# EAGLE design Qwiic_Lidar_Lite (EAGLE 9.4.2)
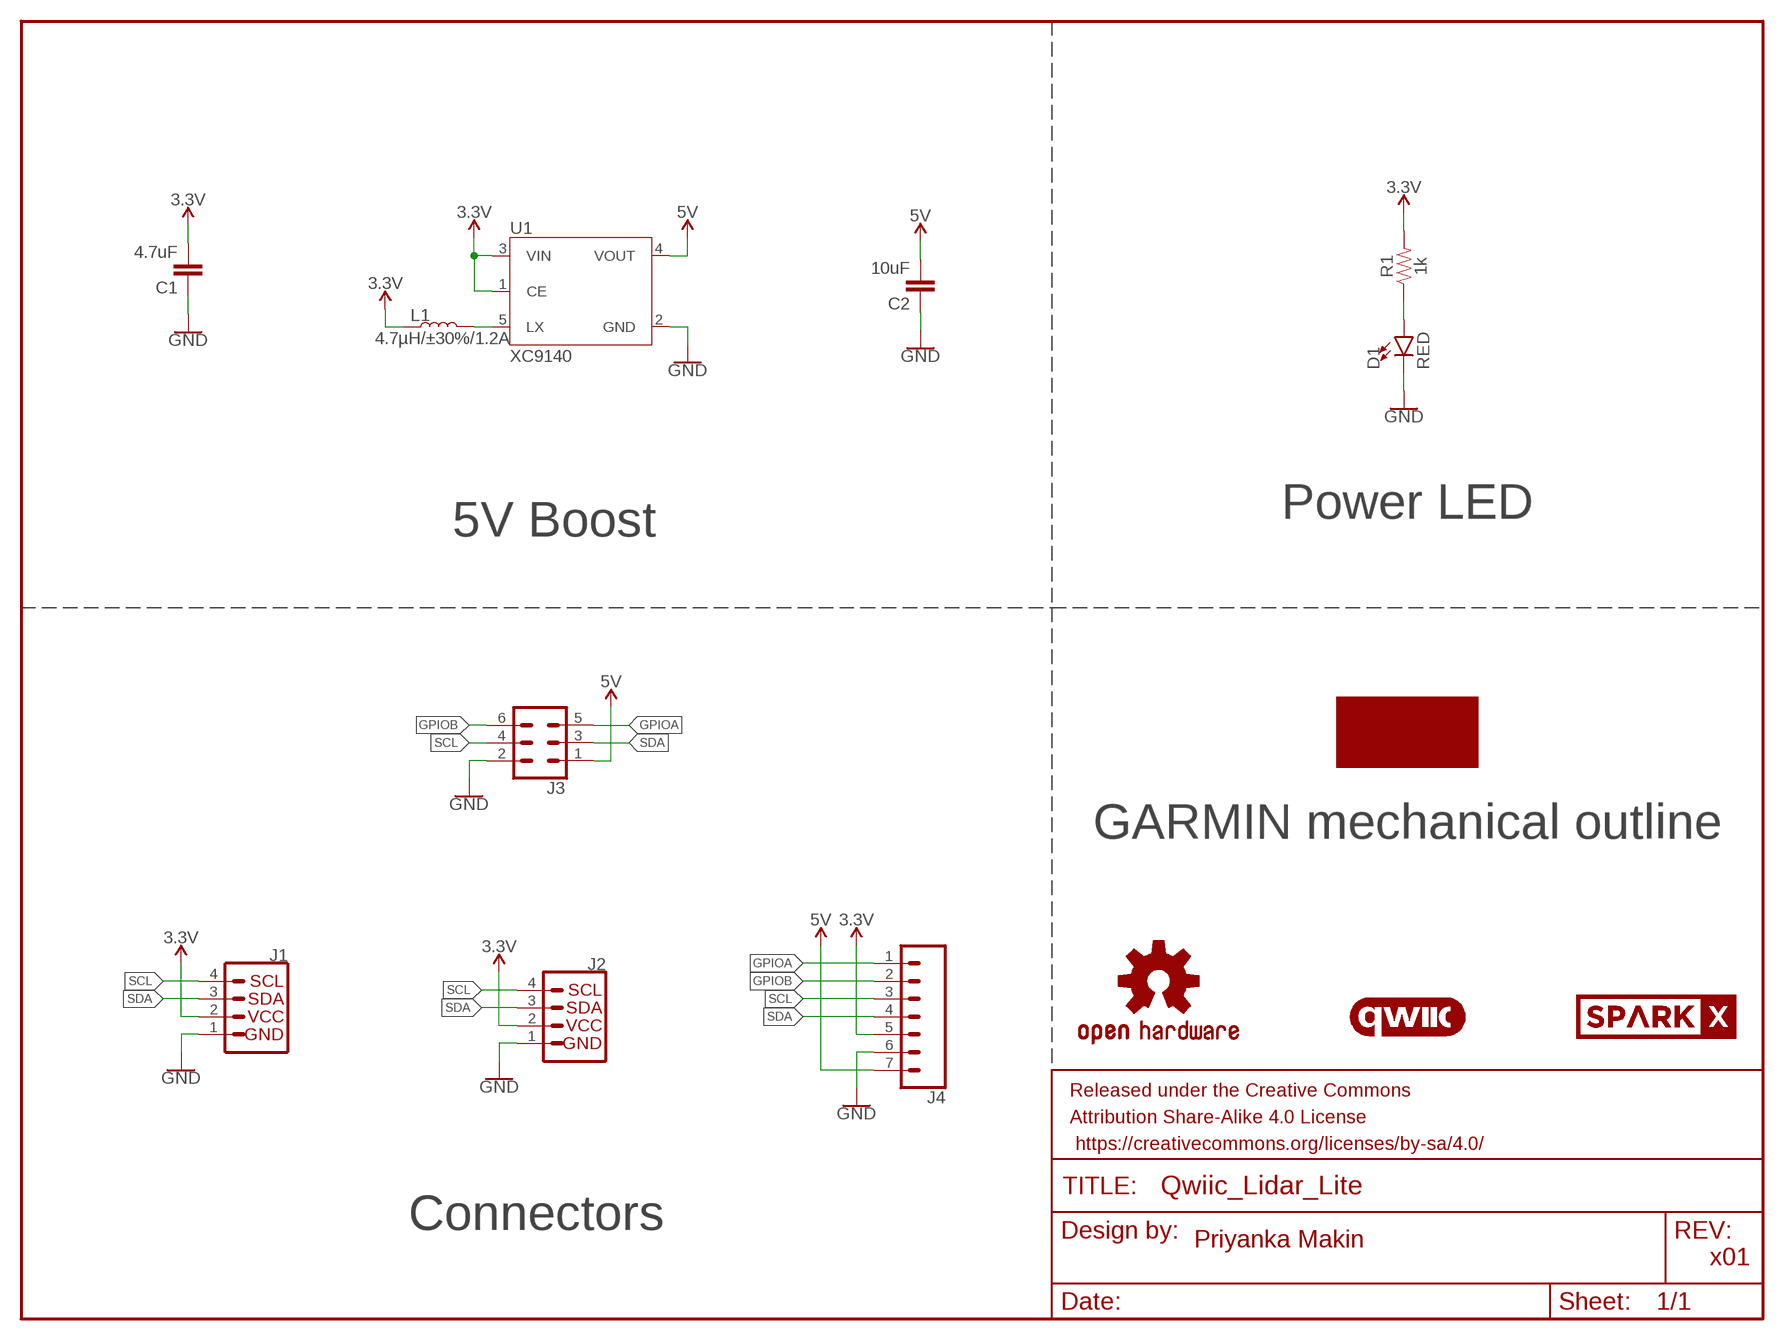
[diagram p0: schematic, sheet 1]

## Parts
C1  4.7uF  4.7UF-0603-6.3V-(10%)  [0603]
C2  10uF  10UF-0603-6.3V-20%  [0603]
D1  RED  LED-RED0603  [LED-0603]
FRAME1  FRAME-LETTER  [CREATIVE_COMMONS]
J1  QWIIC_CONNECTORJS-1MM  [JST04_1MM_RA]
J2  QWIIC_CONNECTORJS-1MM  [JST04_1MM_RA]
J3  CONN_03X22MM  [CONN_3X2_2MM]
J4  CONN_07NO_SILK  [1X07_NO_SILK]
L1  4.7µH/±30%/1.2A  INDUCTOR-CDRH-4.7UH  [INDUCTOR_4.7UH]
LOGO1  QWIIC_LOGO_CONNECTOR  [QWIIC_5.5MM]
LOGO2  OSHW-LOGOMINI  [OSHW-LOGO-MINI]
R1  1k  1KOHM-0603-1/10W-1%  [0603]
U1  XC9140  [SOT23-5]
U$7  LIDAR_LITE  [LIDAR_LITE]
U$8  SPARKX-LOGO4  [SPARKX-MEDIUM]

## Nets
3.3V: C1.2 J1.2 J2.2 J4.5 L1.P$1 R1.2 U1.1(CE) U1.3(VIN)
5V: C2.2 J3.1 J4.7 U1.4(VOUT)
GND: C1.1 C2.1 D1.C J1.1 J2.1 J3.2 J4.6 U1.2(GND)
GPIOA: J3.5 J4.1
GPIOB: J3.6 J4.2
N$1: D1.A R1.1
N$2: L1.P$2 U1.5(LX)
SCL: J1.4 J2.4 J3.4 J4.3
SDA: J1.3 J2.3 J3.3 J4.4

## Notes on the sheet
- Power LED
- 5V Boost
- GARMIN mechanical outline
- Connectors
- Priyanka Makin
- x01

## Library data of the parts
C1 = SparkFun-Capacitors:4.7UF: 4.7µF ceramic capacitors A capacitor is a passive two-terminal electrical component used to store electrical energy temporarily in an electric field.; PROD_ID: CAP-08280
C2 = SparkFun-Capacitors:10UF: 10.0µF ceramic capacitors A capacitor is a passive two-terminal electrical component used to store electrical energy temporarily in an electric field.; PROD_ID: CAP-11015
D1 = SparkFun-LED:LED-RED: Red SMD LED Used in manufacturing of most products at SparkFun Packages: 0603 - SMD 0603 package [Product Link] <http://docs.avagotech.com/docs/AV02-0551EN> 0603 SMART - SMD 0603 SMART package ( more efficient and expensive)[Product Link] <http://www.osram-os.com/Graphics/XPic2/00077099_0.pdf> 1206 - SMD1206 package [Product Link] <https://www.sparkfun.com/datasheets/DevTools/LilyPad/Q150OVS4.pdff> SparkFun Products: Pro Mini 328 -5V <https://www.sparkfun.com/products/821> RedBoard <https://www.sparkfun.com/products/12757> IOIO-OTG <https://www.sparkfun.com/products/13613>; PROD_ID: DIO-00819
FRAME1 = SparkFun-Aesthetics:FRAME-LETTER: Schematic Frame - Letter Standard 8.5x11 US Letter frame
J1 J2 = SparkFun-Connectors:QWIIC_CONNECTOR: SparkFun I2C Standard Qwiic Connector An SMD 1mm pitch JST connector makes it easy and quick (get it? Qwiic?) to connect I2C devices to each other. The Qwiic system <http://www.sparkfun.com/qwiic> enables fast and solderless connection between popular platforms and various sensors and actuators. We carry 200mm <https://www.sparkfun.com/products/14204>, 100mm <https://www.sparkfun.com/products/14205>, 50mm <https://www.sparkfun.com/products/14206>, and breadboard friendly <https://www.sparkfun.com/products/14207> Qwiic cables. We also offer 10 pcs strips <https://www.sparkfun.com/products/14323> the SMD connectors.; PROD_ID: CONN-13694
J3 = SparkFun-Connectors:CONN_03X2: Multi connection point. Often used as Generic Header-pin footprint for 0.1 inch spaced/style header connections You can populate with any combo of single row headers, but if you'd like an exact match, check these: Header - 2x3 (Male, 0.1") <https://www.sparkfun.com/products/12807> (PRT-12807) Header - 2x3 (Female, 0.1") <https://www.sparkfun.com/products/13010> (PRT-13010) 2x3 Pin Shrouded Header <https://www.sparkfun.com/products/10877> (PRT-10877) On any of the 0.1 inch spaced packages, you can populate with these: Break Away Headers - Straight <https://www.sparkfun.com/products/116> (PRT-00116) Break Away Male Headers - Right Angle <https://www.sparkfun.com/products/553> (PRT-00553) Female Headers <https://www.sparkfun.com/products/115> (PRT-00115) Break Away Headers - Machine Pin <https://www.sparkfun.com/products/117> (PRT-00117) Break Away Female Headers - Swiss Machine Pin <https://www.sparkfun.com/products/743> (PRT-00743) Special note: the shrouded connector mates well with our 3x2 ribbon cables: Ribbon Crimp Connector - 6-pin (2x3, Female) <https://www.sparkfun.com/products/10651> (PRT-10651) Ribbon Cable - 6 wire (15ft) <https://www.sparkfun.com/products/10646> (PRT-10646)
J4 = SparkFun-Connectors:CONN_07: Multi connection point. Often used as Generic Header-pin footprint for 0.1 inch spaced/style header connections On any of the 0.1 inch spaced packages, you can populate with these: Break Away Headers - Straight <https://www.sparkfun.com/products/116> (PRT-00116) Break Away Male Headers - Right Angle <https://www.sparkfun.com/products/553> (PRT-00553) Female Headers <https://www.sparkfun.com/products/115> (PRT-00115) Break Away Headers - Machine Pin <https://www.sparkfun.com/products/117> (PRT-00117) Break Away Female Headers - Swiss Machine Pin <https://www.sparkfun.com/products/743> (PRT-00743) For SCREWTERMINALS and SPRING TERMINALS visit here: Screw Terimnals on SparkFun.com <https://www.sparkfun.com/search/results?term=Screw+Terminals> (5mm/3.5mm/2.54mm spacing) This device is also useful as a general connection point to wire up your design to another part of your project. Our various solder wires solder well into these plated through hole pads. Hook-Up Wire - Assortment (Stranded, 22 AWG) <https://www.sparkfun.com/products/11375> (PRT-11375) Hook-Up Wire - Assortment (Solid Core, 22 AWG) <https://www.sparkfun.com/products/11367> (PRT-11367) View the entire wire category on our website here <https://www.sparkfun.com/categories/141> Special notes: Molex polarized connector foot print use with SKU : PRT-08231 with associated crimp pins and housings. 1MM SMD Version SKU: PRT-10208 NOTES ON THE VARIANTS LOCK and LOCK_LONGPADS... This footprint was designed to help hold the alignment of a through-hole component (i.e. 6-pin header) while soldering it into place. You may notice that each hole has been shifted either up or down by 0.005 of an inch from it's more standard position (which is a perfectly straight line). This slight alteration caused the pins (the squares in the middle) to touch the edges of the holes. Because they are alternating, it causes a "brace" to hold the component in place. 0.005 has proven to be the perfect amount of "off-center" position when using our standard breakaway headers. Although looks a little odd when you look at the bare footprint, once you have a header in there, the alteration is very hard to notice. Also,if you push a header all the way into place, it is covered up entirely on the bottom side.
L1 = SparkFun-Coils:INDUCTOR: Inductors Resist changes in electrical current. Basically a coil of wire. SparkFun Products: SparkFun Load Cell Amplifier - HX711 <https://www.sparkfun.com/products/13879> IOIO-OTG - V2.2 <https://www.sparkfun.com/products/13613>; PROD_ID: NDUC-10146
LOGO1 = SparkFun-Aesthetics:QWIIC_LOGO: Qwiic Logos for placement on schematic and PCB. The 5.5mm silk logo is best for placing next to Qwiic connector.
LOGO2 = SparkFun-Aesthetics:OSHW-LOGO: Open-Source Hardware (OSHW) Logo This logo indicates the piece of hardware it is found on incorporates a OSHW license and/or adheres to the definition of open source hardware found here: http://freedomdefined.org/OSHW
R1 = SparkFun-Resistors:1KOHM: 1kΩ resistor A resistor is a passive two-terminal electrical component that implements electrical resistance as a circuit element. Resistors act to reduce current flow, and, at the same time, act to lower voltage levels within circuits. - Wikipedia; PROD_ID: RES-07856
U1 = SparkFun-IC-Power:XC9140: Torex Semi Conductor Ltd XC9140A501MR-G - Boost switching regulator IC, Fixed 5V output SparkFun Products: Qwiic Lidar Lite <[PRODUCT1LINK]>
U$7 = Qwiic_Lidar_Lite:LIDAR_LITE
U$8 = SparkX:SPARKX-LOGO

## Board
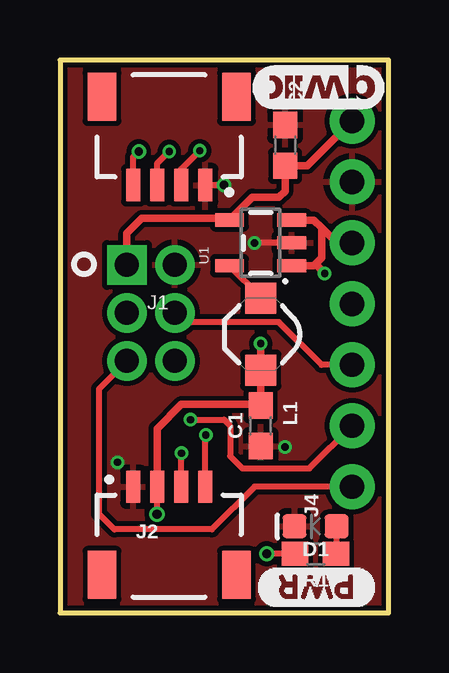
[diagram p1: board, top side]
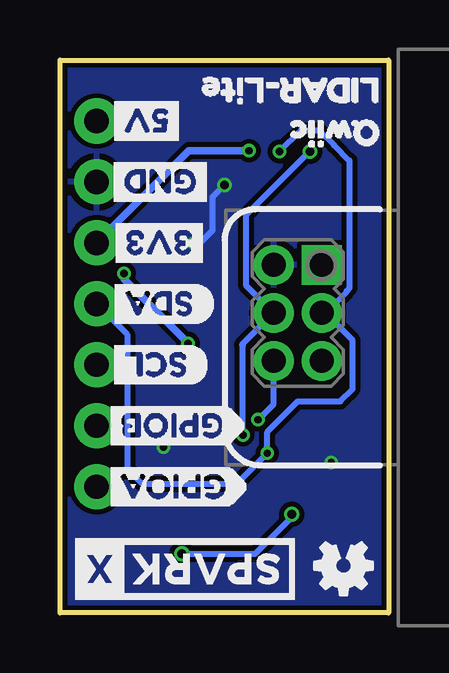
[diagram p2: board, bottom side, seen from below]

Size 13.7 x 23.04 mm. Coordinates in mm from the lower left corner, seen from the top.
Outline: 13.7,23.04 0,23.04 0,0 13.7,0 13.7,23.04
Copper layers (1*16): Top 0.035mm / dielectric 1.5mm / Bottom 0.035mm
Design rules "SparkFun-2-layer-FAB-LIMIT": minimum track width 4mil, minimum drill 6mil, track to track 4mil, track to pad 4mil, pad to pad 4mil, via to via 4mil, smd to smd 4mil, copper to edge 4mil, drill to drill 4mil, minimum pad ring 5mil, minimum via ring 5mil, stop-mask expansion 4mil, vias tented up to drill 25mil, thermal gap 10mil

### Footprints (pad centres in the part's own frame; a part is rotated, then mirrored left to right if it is on the bottom)
0603 = smd 1.1 x 1: 1 -0.85,0; 2 0.85,0
LED-0603 = smd 1 x 1: A -0.877,0; C 0.877,0
JST04_1MM_RA = smd 0.6 x 1.35: 1 -1.5,0; 2 -0.5,0; 3 0.5,0; 4 1.5,0 | smd 1.2 x 2: NC1 2.8,-3.675; NC2 -2.8,-3.675
CONN_3X2_2MM = drill 1 pad 1.651 square: 1 -2,1 | drill 1 pad 1.651: 2 -2,-1; 3 0,1; 4 0,-1; 5 2,1; 6 2,-1
1X07_NO_SILK = drill 1.016 pad 1.88: 1 0,0; 2 2.54,0; 3 5.08,0; 4 7.62,0; 5 10.16,0; 6 12.7,0; 7 15.24,0
INDUCTOR_4.7UH = smd 1.3 x 1.3: P$1 -1.5,0; P$2 1.5,0
SOT23-5 = smd 0.55 x 1.2: 1 -0.95,-1.3; 2 0,-1.3; 3 0.95,-1.3; 4 0.95,1.3; 5 -0.95,1.3

### Placement (x,y rotation side)
C1  8.36,7.8 90 top
C2  9.38,19.48 270 top
D1  10.65,3.61 180 top
FRAME1  -10.69,-12.52 0 top  (outside the outline)
J1  4.55,17.82 180 top
J2  4.55,5.26 0 top
J3  3.79,12.5 270 bottom
J4  12.17,5.26 90 top
L1  8.36,11.61 90 top
LOGO1  10.78,21.89 180 top
LOGO2  1.88,1.96 180 bottom
R1  10.65,2.46 180 top
U1  8.36,15.42 90 top
U$1  [GND3]  7.09,17.96 180 bottom
U$2  [3V30]  7.22,15.42 180 bottom
U$3  [GPIOA5]  5.82,5.26 180 bottom
U$4  [GPIOB2]  5.95,7.8 180 bottom
U$5  [SCL1]  7.47,10.34 180 bottom
U$6  [SDA4]  7.22,12.88 180 bottom
U$7  -22.88,11.48 180 bottom  (outside the outline)
U$8  8.49,1.83 180 bottom
U$9  [QWIIC0]  -0.53,19.99 180 bottom
U$10  [5V0]  8.23,20.5 180 bottom
U$11  [LIDAR#LITE1]  -0.53,21.77 180 bottom
U$12  [PWR0]  13.19,1.07 180 top

### Tracks (layer width: path | path; a pad name or v marks a point on that pad's centre or on a via)
3.3V  (via drill 0.3, 0.38)
  Top 0.254: 10.58,14.47 10.71,14.47 | 8.32,8.69 C1.2 | J1.2 5.05,18.49 v5.82,19.26 | J2.2 v4.04,4.12 | R1.2 v8.62,2.46
  Top 0.305: C1.2 L1.P$1 v8.36,11.23 | U1.3 10.58,16.37 10.9,16.05 | U1.1 10.58,14.47 10.9,14.79 10.9,16.05 | 10.71,14.47 v11.03,14.15 | J2.2 4.05,7.68 5.06,8.69 8.32,8.69 | J4.5 11.53,15.42 10.9,16.05
  Bottom 0.254: 11.03,13.89 v11.03,14.15 | v8.62,2.46 5.57,2.46 4.04,3.99 v4.04,4.12
  Bottom 0.305: v8.36,11.23 11.03,13.89 | v5.82,19.26 8.33,19.26 J4.5
5V
  Top 0.254: 7,16.43 U1.4
  Top 0.305: J3.1 2.79,15.81 3.41,16.43 7,16.43 | U1.4 8.02,17.32 9.12,17.32 9.38,17.58 C2.2 10.31,18.63 J4.7
GND  (via drill 0.3, 0.35)
  Top 0.254: U1.2 v8.11,15.42 | J1.1 6.06,17.83 v6.84,17.83
  Bottom 0.254: v6.84,17.83 7.35,17.32 7.35,15.93 7.85,15.42 v8.11,15.42
  other vias: 9.38,6.91 2.39,6.27
  pour Top (isolate 0.203): -0.02,23.04 13.44,23.04 13.44,-0.08 -0.02,-0.08
  pour Bottom (isolate 0.203): -0.02,23.04 13.57,23.04 13.57,-0.08 -0.02,-0.08
GPIOA
  Top 0.254: J3.5 1.63,9.34 1.63,4.12 2.27,3.48 6.33,3.48 8.11,5.26 J4.1
GPIOB  (via drill 0.3)
  Top 0.254: J4.2 10.39,6.02 7.6,6.02 7.09,6.53 7.09,7.8 6.84,8.05 v5.44,8.05
  Bottom 0.254: v5.44,8.05 4.79,8.7 J3.6
N$1
  Top 0.254: R1.1 11.53,2.49 D1.A
N$2
  Top 0.254: U1.5 8.36,13.17 L1.P$2
SCL  (via drill 0.3, 0.35)
  Top 0.254: J4.3 10.9,10.34 9.12,12.12 5.17,12.12 J3.4 | J2.4 6.05,7.39 v6.08,7.42 | J1.4 3.05,19 v3.28,19.23
  Bottom 0.254: v3.28,19.23 5.95,16.56 5.95,13.66 J3.4 6.11,11.17 6.08,11.13 v6.08,7.42
SDA  (via drill 0.3)
  Top 0.254: J2.3 v5.05,6.65 v5.06,6.65 | J1.3 4.05,18.73 v4.55,19.23
  Bottom 0.254: 2.65,12.5 1.5,11.35 1.5,9.32 2.01,8.81 3.79,8.81 5.06,7.54 v5.06,6.65 6.33,5.38 10.27,5.38 10.9,6.02 10.9,11.61 J4.4 | 2.65,12.5 J3.3 | v4.55,19.23 4.54,19.23 3.65,20.12 2.91,20.12 2.28,19.48 2.27,19.48 1.63,18.85 1.63,13.54 1.76,13.41 1.76,13.39 2.65,12.5